# Altium project Git Test - Source Tree.PrjPcb
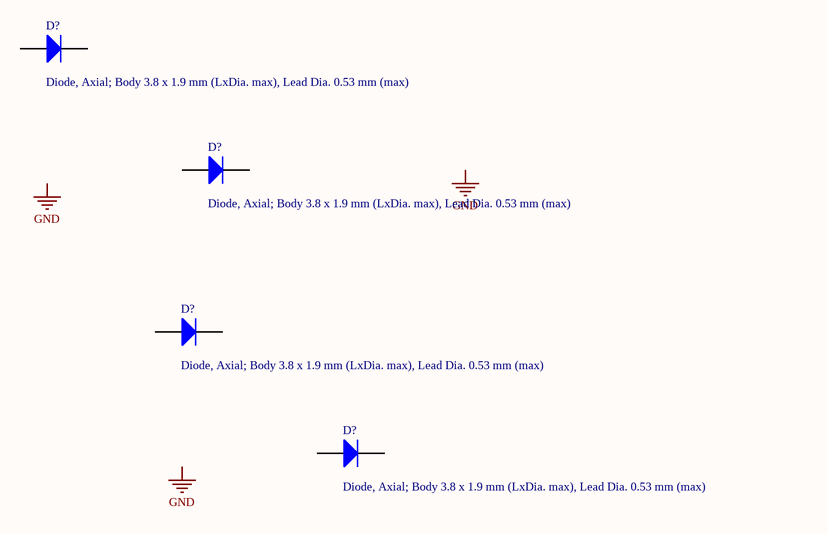
[diagram p0: Sheet1.SchDoc]
2 sheets, 4 parts. Net scope: global (net labels, ports and power ports of the same name join across sheets).
Board file: PCB1.PcbDoc
Sheets:
  Sheet1.SchDoc
  Sheet2.SchDoc

## Sheet Sheet1.SchDoc
size A4; SheetNumber: 1; SheetTotal: 2; SPICEModelCacheCIQUKPAD: <root> / <DocumentId>CIQUKPAD</DocumentId> / <CacheFrame Number="0"> / <Model Name="1n914" Kind="MDL"> / <Text>.model 1N914 D(Is=0.1p Rs=16 CJO=2p Tt=12n Bv=100 Ibv=0.1p)</Text> / </Model> / </CacheFrame> / </root>

### Parts
(Parts that share a designator on the sheet are numbered #1, #2 ... from top to bottom, then left to right.)
D?#1  Case/Package: Diode, Axial; Body 3.8 x 1.9 mm (LxDia. max), Lead Dia. 0.53 mm (max)  [DO-35]  (hidden comment: Diode 1N914)
D?#2  Case/Package: Diode, Axial; Body 3.8 x 1.9 mm (LxDia. max), Lead Dia. 0.53 mm (max)  [DO-35]  (hidden comment: Diode 1N914)
D?#3  Case/Package: Diode, Axial; Body 3.8 x 1.9 mm (LxDia. max), Lead Dia. 0.53 mm (max)  [DO-35]  (hidden comment: Diode 1N914)
D?#4  Case/Package: Diode, Axial; Body 3.8 x 1.9 mm (LxDia. max), Lead Dia. 0.53 mm (max)  [DO-35]  (hidden comment: Diode 1N914)

### Nets

Not connected (* = marked no-connect by the designer): D?#1 1(A) 2(K); D?#2 1(A) 2(K); D?#3 1(A) 2(K); D?#4 1(A) 2(K)

### Notes on the sheet
- Labels drawn without touching a wire or pin: GND

### Library data of the parts
D?#1-D?#4 = CMP-004-00063-1: High Conductance Fast Diode; Published: 8-Jun-2000; Publisher: Altium Limited; Source: Miscellaneous Devices.SchLib; Pins: 2; ComponentLink2Description: Datasheet; Design Item ID: Diode 1N914; ComponentLink1Description: Manufacturer Link; PackageReference: DO-35; ComponentLink1URL: http://www.fairchildsemi.com/; LatestRevisionNote: Re-released for DXP Platform.; Component Type: Standard; Signal Integrity: 1N914; Code_JEDEC: DO-204-AH; DatasheetVersion: 1997; ComponentLink2URL: http://www.fairchildsemi.com/ds/1N%2F1N4448.pdf; LatestRevisionDate: 17-Jul-2002

## Sheet Sheet2.SchDoc
size A4; SheetNumber: 2; SheetTotal: 2
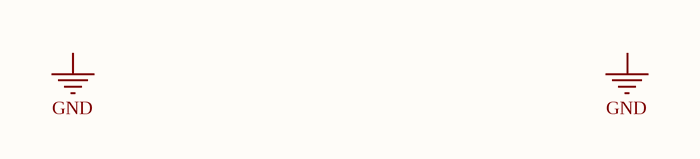
[diagram p1: Sheet2.SchDoc]

### Notes on the sheet
- Labels drawn without touching a wire or pin: GND